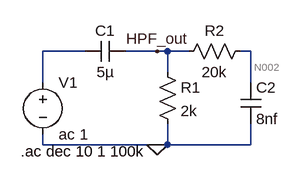
[diagram p0: schematic Hw5_3.asc]
Hw5_3.asc, the LTspice schematic file:
Version 4
SHEET 1 880 680
WIRE 160 64 96 64
WIRE 272 64 224 64
WIRE 288 64 272 64
WIRE 320 64 288 64
WIRE 416 64 400 64
WIRE 288 96 288 64
WIRE 96 112 96 64
WIRE 416 112 416 64
WIRE 96 208 96 192
WIRE 272 208 96 208
WIRE 288 208 288 176
WIRE 288 208 272 208
WIRE 416 208 416 176
WIRE 416 208 288 208
FLAG 272 208 0
FLAG 272 64 HPF_out
SYMBOL voltage 96 96 R0
SYMATTR InstName V1
SYMATTR Value ac 1
SYMBOL cap 224 48 R90
WINDOW 0 0 32 VBottom 2
WINDOW 3 32 32 VTop 2
SYMATTR InstName C1
SYMATTR Value 5µ
SYMBOL res 272 80 R0
SYMATTR InstName R1
SYMATTR Value 2k
SYMBOL res 416 48 R90
WINDOW 0 0 56 VBottom 2
WINDOW 3 32 56 VTop 2
SYMATTR InstName R2
SYMATTR Value 20k
SYMBOL cap 400 112 R0
SYMATTR InstName C2
SYMATTR Value 8nf
TEXT 62 218 Left 2 !.ac dec 10 1 100k

The netlist it stands for:
* Hw5_3.asc
V1 N001 0 ac 1
C1 HPF_out N001 5µ
R1 HPF_out 0 2k
R2 N002 HPF_out 20k
C2 N002 0 8nf
.ac dec 10 1 100k
.backanno
.end

* Results of the author's LTspice run, read from the files saved beside the schematic
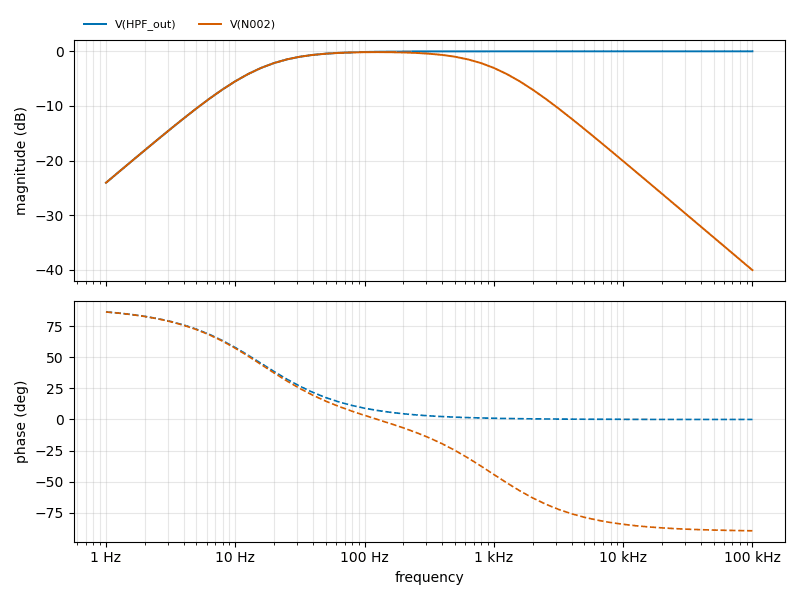
[diagram p1: AC Analysis of Hw5_3.asc, plotted from the saved traces]
* AC Analysis, 1 run:
*   V(HPF_out): -24.05 dB at 1 Hz, -0.00 dB at 100 kHz, peak -0.00 dB at 100 kHz, 3 dB below the peak at 15.95 Hz
*   V(N002): -24.05 dB at 1 Hz, -40.05 dB at 100 kHz, peak -0.15 dB at 125.9 Hz, 3 dB below the peak at 15.44 Hz and 1.025 kHz